# EAGLE design AtMEGA32u4-uSD-AddON-v03 (EAGLE 5.11)
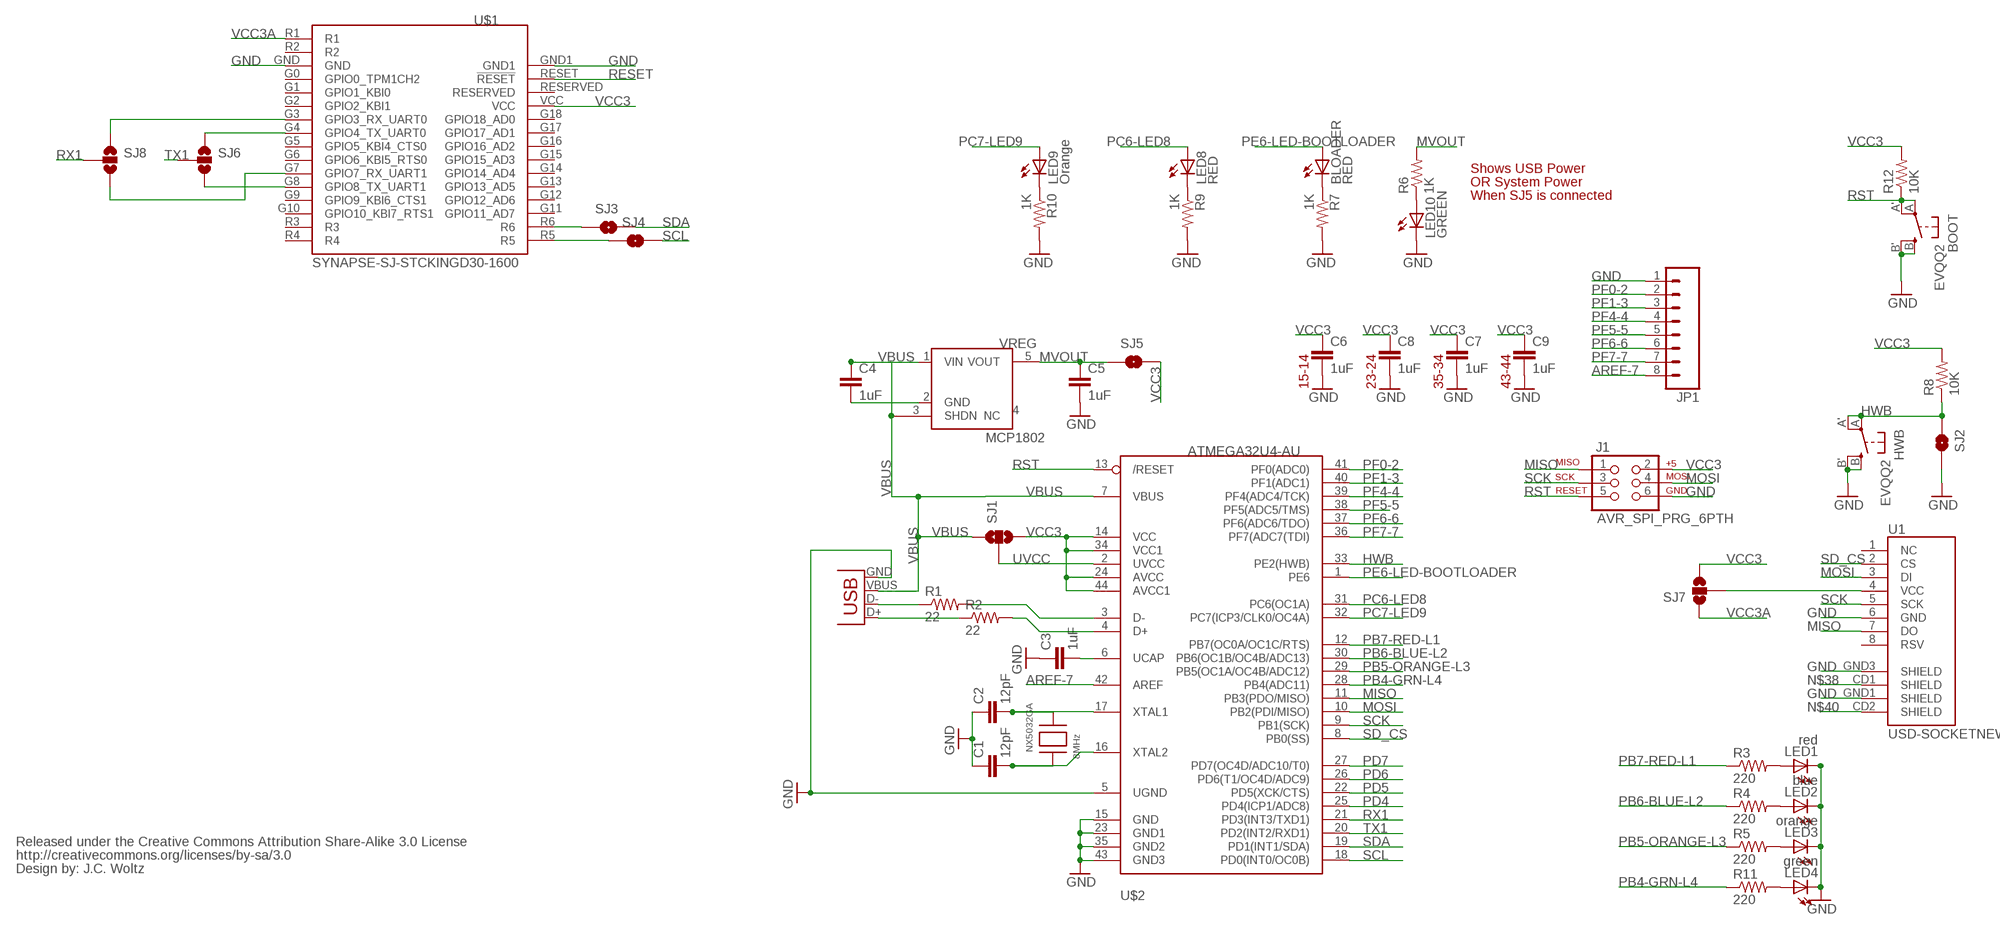
[diagram p0: schematic, sheet 1]

## Parts
BLOADER  RED  LED0603  [LED-0603]
BOOT  EVQQ2  [EVQ-Q2]
C1  12pF  CAP0603-CAP  [0603-CAP]
C2  12pF  CAP0603-CAP  [0603-CAP]
C3  1uF  CAP0603-CAP  [0603-CAP]
C4  1uF  CAP0603-CAP  [0603-CAP]
C5  1uF  CAP0603-CAP  [0603-CAP]
C6  1uF  CAP0603-CAP  [0603-CAP]
C7  1uF  CAP0603-CAP  [0603-CAP]
C8  1uF  CAP0603-CAP  [0603-CAP]
C9  1uF  CAP0603-CAP  [0603-CAP]
HWB  EVQQ2  [EVQ-Q2]
J1  AVR_SPI_PRG_6PTH  [2X3]
JP1  M08  [1X08]
LED1  red  LED0603  [LED-0603]
LED2  blue  LED0603  [LED-0603]
LED3  orange  LED0603  [LED-0603]
LED4  green  LED0603  [LED-0603]
LED8  RED  LED0603  [LED-0603]
LED9  Orange  LED0603  [LED-0603]
LED10  GREEN  LED0603  [LED-0603]
NX5032GA  8MHz  XTALNX5032  [NX5032]
R1  22  RESISTOR0603-RES  [0603-RES]
R2  22  RESISTOR0603-RES  [0603-RES]
R3  220  RESISTOR0603-RES  [0603-RES]
R4  220  RESISTOR0603-RES  [0603-RES]
R5  220  RESISTOR0603-RES  [0603-RES]
R6  1K  RESISTOR0603-RES  [0603-RES]
R7  1K  RESISTOR0603-RES  [0603-RES]
R8  10K  RESISTOR0603-RES  [0603-RES]
R9  1K  RESISTOR0603-RES  [0603-RES]
R10  1K  RESISTOR0603-RES  [0603-RES]
R11  220  RESISTOR0603-RES  [0603-RES]
R12  10K  RESISTOR0603-RES  [0603-RES]
SJ1  SOLDERJUMPER_2WAYPASTE2&3  [SJ_3_PASTE2&3]
SJ2  HWB  SOLDERJUMPERNO  [SJ_2S-NO]
SJ3  SOLDERJUMPERNO  [SJ_2S-NO]
SJ4  SOLDERJUMPERNO  [SJ_2S-NO]
SJ5  SOLDERJUMPERNO  [SJ_2S-NO]
SJ6  SOLDERJUMPER_2WAYPASTE1&2  [SJ_3_PASTE1&2]
SJ7  SOLDERJUMPER_2WAYPASTE1&2  [SJ_3_PASTE1&2]
SJ8  SOLDERJUMPER_2WAYPASTE1&2  [SJ_3_PASTE1&2]
U1  USD-SOCKETNEW  [MICRO-SD-SOCKET-PP]
U$1  SYNAPSE-SJ-STCKINGD30-1600  [SYNSJ-STACK]
U$2  ATMEGA32U4-AU  [TQFP44]
U$5  CREATIVE_COMMONS  [CREATIVE_COMMONS]
VREG  MCP1802  [SOT23-5]
X1  USBSMD  USBH2959CT-ND  [USB-MINIB]

## Nets
AREF-7: JP1.8 U$2.42(AREF)
GND: BOOT.B'(S1) BOOT.B(S) C1.1 C2.1 C3.1 C4.2 C5.2 C6.2 C7.2 C8.2 C9.2 HWB.B'(S1) HWB.B(S) J1.6 JP1.1 LED1.C LED2.C LED3.C LED4.C LED10.C R7.2 R9.2 R10.2 SJ2.2 U1.6(GND) U1.GND1(SHIELD) U1.GND3(SHIELD) U$1.GND U$1.GND1 U$2.5(UGND) U$2.15(GND) U$2.23(GND1) U$2.35(GND2) U$2.43(GND3) VREG.2(GND) X1.GND
HWB [smallsignal]: HWB.A'(P1) HWB.A(P) R8.1 SJ2.1 U$2.33(PE2(HWB))
MISO: J1.1 U1.7(DO) U$2.11(PB3(PDO/MISO))
MOSI: J1.4 U1.3(DI) U$2.10(PB2(PDI/MISO))
MVOUT: C5.1 R6.2 SJ5.1 VREG.5(VOUT)
N$1: LED9.C R10.1
N$2: LED1.A R3.2
N$3: SJ7.2 U1.4(VCC)
N$4: C3.2 U$2.6(UCAP)
N$5: LED4.A R11.2
N$7: LED2.A R4.2
N$8: LED10.A R6.1
N$9: LED8.C R9.1
N$10: BLOADER.C R7.1
N$11: SJ3.1 U$1.R6
N$12: LED3.A R5.2
N$13: SJ4.1 U$1.R5
N$14: SJ8.1 U$1.G3(GPIO3_RX_UART0)
N$15: SJ6.1 U$1.G4(GPIO4_TX_UART0)
N$16: SJ8.3 U$1.G7(GPIO7_RX_UART1)
N$17: SJ6.3 U$1.G8(GPIO8_TX_UART1)
N$38: U1.CD1(SHIELD)
N$40: U1.CD2(SHIELD)
PB4-GRN-L4: R11.1 U$2.28(PB4(ADC11))
PB5-ORANGE-L3: R5.1 U$2.29(PB5(OC1A/OC4B/ADC12))
PB6-BLUE-L2: R4.1 U$2.30(PB6(OC1B/OC4B/ADC13))
PB7-RED-L1: R3.1 U$2.12(PB7(OC0A/OC1C/RTS))
PC6-LED8: LED8.A U$2.31(PC6(OC1A))
PC7-LED9: LED9.A U$2.32(PC7(ICP3/CLK0/OC4A))
PD4: U$2.25(PD4(ICP1/ADC8))
PD5: U$2.22(PD5(XCK/CTS))
PD6: U$2.26(PD6(T1/OC4D/ADC9))
PD7: U$2.27(PD7(OC4D/ADC10/T0))
PE6-LED-BOOTLOADER: BLOADER.A U$2.1(PE6)
PF0-2: JP1.2 U$2.41(PF0(ADC0))
PF1-3: JP1.3 U$2.40(PF1(ADC1))
PF4-4: JP1.4 U$2.39(PF4(ADC4/TCK))
PF5-5: JP1.5 U$2.38(PF5(ADC5/TMS))
PF6-6: JP1.6 U$2.37(PF6(ADC6/TDO))
PF7-7: JP1.7 U$2.36(PF7(ADC7(TDI))
RESET: U$1.RESET(!RESET)
RST [smallsignal]: BOOT.A'(P1) BOOT.A(P) J1.5 R12.1 U$2.13(/RESET)
RX1: SJ8.2 U$2.21(PD3(INT3/TXD1))
SCK: J1.3 U1.5(SCK) U$2.9(PB1(SCK))
SCL: SJ4.2 U$2.18(PD0(INT0/OC0B))
SD_CS: U1.2(CS) U$2.8(PB0(SS))
SDA: SJ3.2 U$2.19(PD1(INT1/SDA))
TX1: SJ6.2 U$2.20(PD2(INT2/RXD1))
UD+: R2.2 U$2.4(D+)
UD-: R1.2 U$2.3(D-)
UDM: R1.1 X1.D-
UDP: R2.1 X1.D+
UVCC: SJ1.2 U$2.2(UVCC)
VBUS: C4.1 SJ1.1 U$2.7(VBUS) VREG.1(VIN) VREG.3(SHDN) X1.VBUS
VCC3: C6.1 C7.1 C8.1 C9.1 J1.2 R8.2 R12.2 SJ1.3 SJ5.2 SJ7.3 U$1.VCC U$2.14(VCC) U$2.24(AVCC) U$2.34(VCC1) U$2.44(AVCC1)
VCC3A: SJ7.1 U$1.R1
XTAL1: C2.2 NX5032GA.P$2 U$2.17(XTAL1)
XTAL2: C1.2 NX5032GA.P$1 U$2.16(XTAL2)
Unconnected: U1.1(NC) U1.8(RSV) U$1.G0(GPIO0_TPM1CH2) U$1.G1(GPIO1_KBI0) U$1.G2(GPIO2_KBI1) U$1.G5(GPIO5_KBI4_CTS0) U$1.G6(GPIO6_KBI5_RTS0) U$1.G9(GPIO9_KBI6_CTS1) U$1.G10(GPIO10_KBI7_RTS1) U$1.G11(GPIO11_AD7) U$1.G12(GPIO12_AD6) U$1.G13(GPIO13_AD5) U$1.G14(GPIO14_AD4) U$1.G15(GPIO15_AD3) U$1.G16(GPIO16_AD2) U$1.G17(GPIO17_AD1) U$1.G18(GPIO18_AD0) U$1.R2 U$1.R3 U$1.R4 U$1.RESERVED VREG.4(NC)

## Notes on the sheet
- Shows USB Power
- OR System Power
- When SJ5 is connected
- 15-14 | 23-24 | 35-34 | 43-44

## Library data of the parts
BLOADER LED1-LED4 LED8-LED10 = 0_jc-custom:LED: LEDs Standard schematic elements and footprints for 5mm, 3mm, 1206, and 0603 sized LEDs. 5mm - Spark Fun Electronics SKU : COM-00529 (and others)
BOOT HWB = adaprog:EVQQ2
C1 C2 = SparkFun:CAP: Capacitor Standard 0603 ceramic capacitor, and 0.1" leaded capacitor.
C3-C9 = 0_jc-custom:CAP: Capacitor Standard 0603 ceramic capacitor, and 0.1" leaded capacitor.
J1 = SparkFun:AVR_SPI_PRG_6: AVR ISP 6 Pin This is the reduced ISP connector for AVR programming. Common on Arduino. This footprint will take up less PCB space and can be used with a 10-pin to 6-pin adapter such as SKU: BOB-08508
JP1 = SparkFun:M08: Header 8 Standard 8-pin 0.1" header. Use with straight break away headers (SKU : PRT-00116), right angle break away headers (PRT-00553), swiss pins (PRT-00743), machine pins (PRT-00117), and female headers (PRT-00115).
NX5032GA = adafruit:XTAL: Low cost SMT crystals, no capacitors included http://www.ladyada.net/library/eagle
R1-R12 = 0_jc-custom:RESISTOR
SJ1 SJ6-SJ8 = SparkFun:SOLDERJUMPER_2WAY: Solder Jumper 2 way solder jumper
SJ2-SJ5 = SparkFun:SOLDERJUMPER: Solder Jumper Standard SMD solder jumper. Used to automate production. Two varients : Normally Open and Normally Closed are the same, but have different paste layers. NC will have a large amount of paste and should jumper during reflow.
U1 = 0_jc-modified:USD-SOCKET: microSD Socket Push-push type uSD socket. Schematic element and footprint production proven. Spark Fun Electronics SKU : PRT-00127. tDoc lines correctly indicate media card edge positions when inserting (unlocked, locked, depressed).
U$1 = 0_jc-custom:SYNAPSE-SJ-STCKING: Standard layout for expansion modules using Synapse Wireless boards
U$2 = adafruit:ATMEGA32U4: http://www.ladyada.net/library/eagle
U$5 = 0_jc-custom:CREATIVE_COMMONS
VREG = 0_jc-custom:MCP1802
X1 = 0_jc-custom:USB: USB Connectors Fully proven 670-1190-1-ND http://search.digikey.com/scripts/DkSearch/dksus.dll?Detail&name=670-1190-1-ND

## Net classes
0 default: width 0.203 mm
1 smallsignal: width 0.152 mm
2 bigsignal: width 0.356 mm

## Board
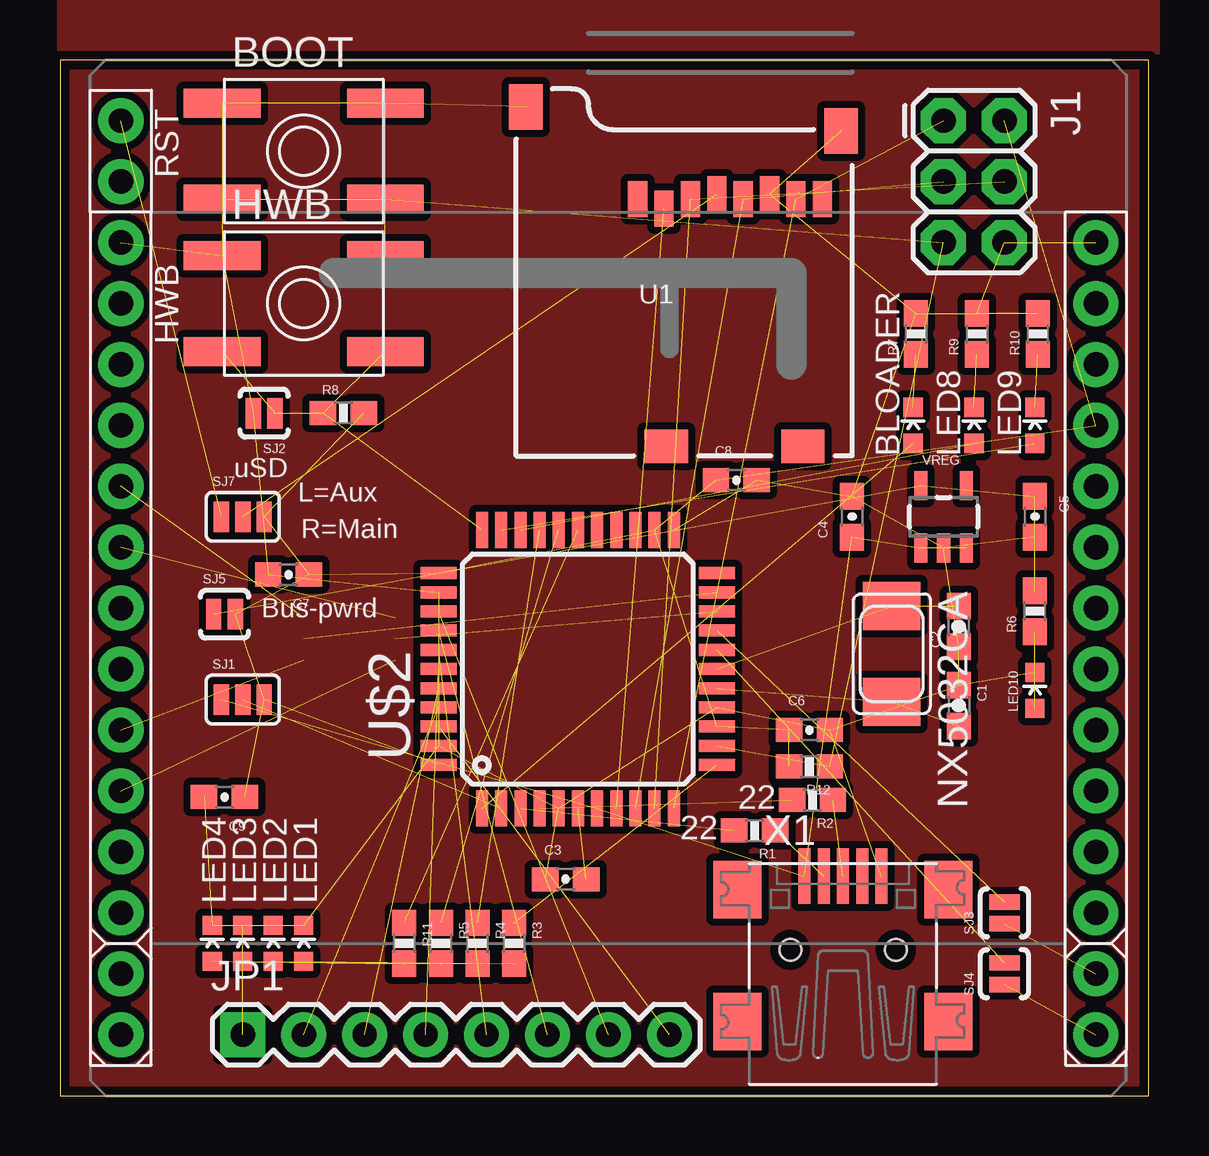
[diagram p1: board, top side]
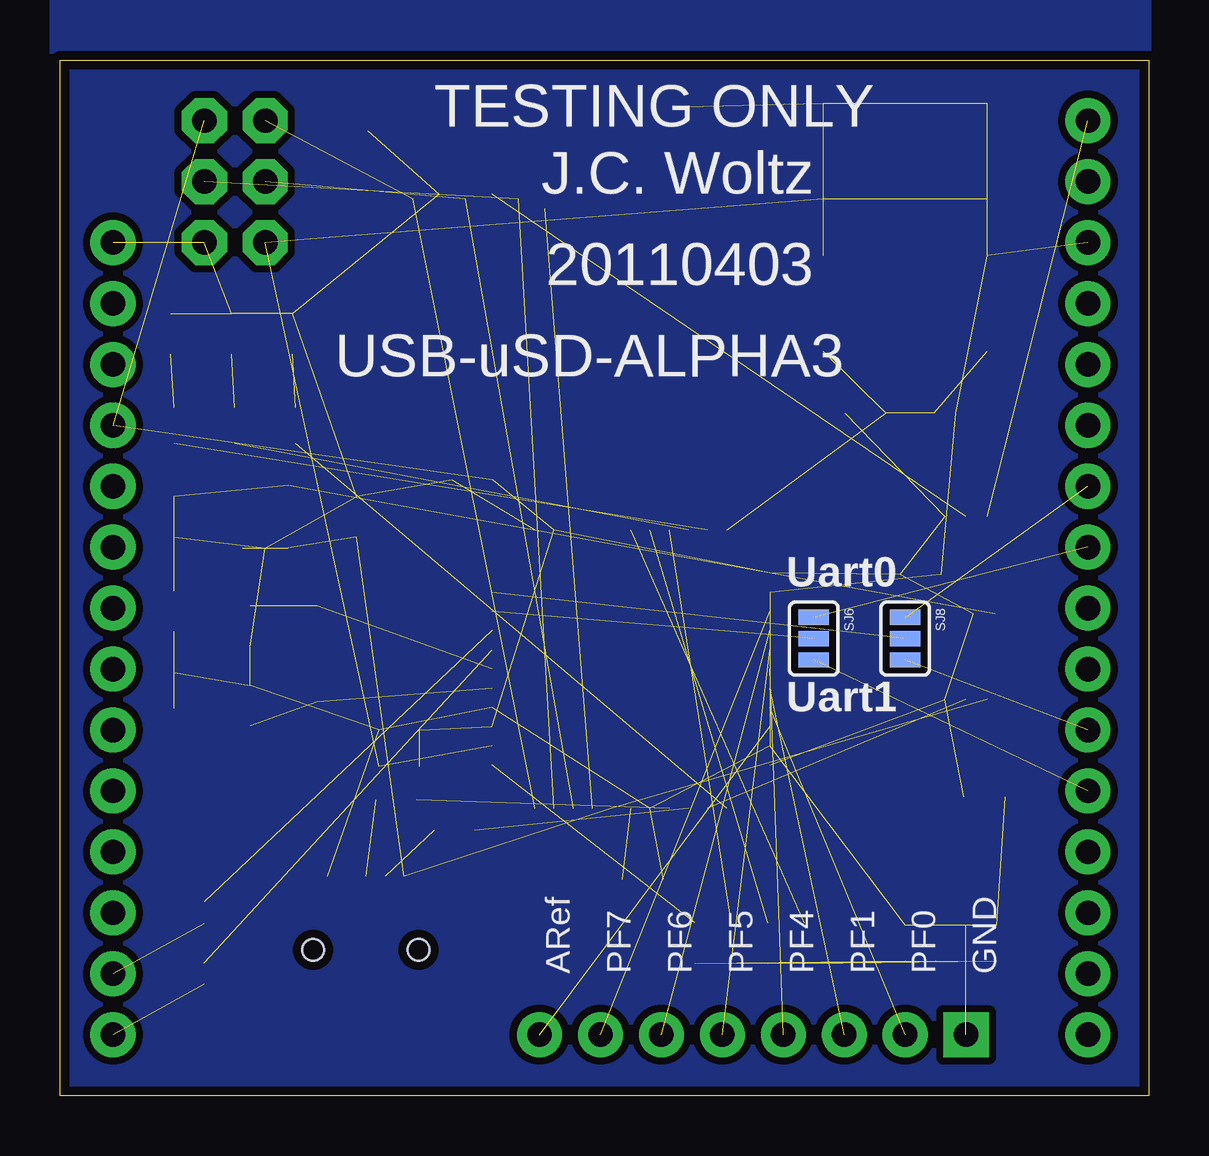
[diagram p2: board, bottom side, seen from below]

Size 45.39 x 43.17 mm. Coordinates in mm from the lower left corner, seen from the top.
Outline: 0,0 45.39,0 45.39,43.17 0,43.17 0,0
Copper layers (1*16): Top 0.0356mm / dielectric 1.5011mm / Bottom 0.0356mm
Design rules "LaenPCBOrder-JCModified": minimum track width 6mil, minimum drill 13mil, track to track 6mil, track to pad 6mil, pad to pad 6mil, via to via 6mil, smd to smd 6mil, copper to edge 15mil, drill to drill 6mil, minimum pad ring 12mil, minimum via ring 7mil, stop-mask expansion 4mil, vias tented up to drill 25mil, thermal gap 10mil

### Footprints (pad centres in the part's own frame; a part is rotated, then mirrored left to right if it is on the bottom)
LED-0603 = smd 0.8 x 0.8: A 0,-0.75; C 0,0.75
EVQ-Q2 = smd 3.2 x 1.2: A -3.4,-2; A' 3.4,-2; B -3.4,2; B' 3.4,2
0603-CAP = smd 1.1 x 1: 1 -0.85,0; 2 0.85,0
2X3 = drill 1.016 pad 1.88 octagon: 1 0,0; 2 0,2.54; 3 2.54,0; 4 2.54,2.54; 5 5.08,0; 6 5.08,2.54
1X08 = drill 1.016 pad 1.88 square: 1 0,0 | drill 1.016 pad 1.88 round: 2 2.54,0; 3 5.08,0; 4 7.62,0; 5 10.16,0; 6 12.7,0; 7 15.24,0; 8 17.78,0
NX5032 = smd 2 x 2.4: P$1 2,0; P$2 -2,0
0603-RES = smd 1.1 x 1: 1 -0.85,0; 2 0.85,0
SJ_3_PASTE2&3 = smd 0.635 x 1.27: 1 -0.889,0; 2 0,0; 3 0.889,0
SJ_2S-NO = smd 0.635 x 1.27: 1 -0.45,0; 2 0.45,0
SJ_3_PASTE1&2 = smd 0.635 x 1.27: 1 -0.889,0; 2 0,0; 3 0.889,0
MICRO-SD-SOCKET-PP = smd 0.8 x 1.5: 1 -8.94,10.7; 2 -7.84,10.3; 3 -6.74,10.7; 4 -5.64,10.9; 5 -4.54,10.7; 6 -3.44,10.9; 7 -2.34,10.7; 8 -1.24,10.7 | smd 1.8 x 1.4: CD1 -2.05,0.4; CD2 -7.75,0.4 | smd 1.4 x 1.9: GND1 -13.6,14.55; GND3 -0.45,13.55
SYNSJ-STACK = drill 1.016 pad 1.88 round: G0 0,-7.62; G1 0,-10.16; G2 0,-12.7; G3 0,-15.24; G4 0,-17.78; G5 0,-20.32; G6 0,-22.86; G7 0,-25.4; G8 0,-27.94; G9 0,-30.48; G10 0,-33.02; G11 40.64,-33.02; G12 40.64,-30.48; G13 40.64,-27.94; G14 40.64,-25.4; G15 40.64,-22.86; G16 40.64,-20.32; G17 40.64,-17.78; G18 40.64,-15.24; GND 0,-5.08; GND1 40.64,-5.08; R1 0,0; R2 0,-2.54; R3 0,-35.56; R4 0,-38.1; R5 40.64,-38.1; R6 40.64,-35.56; RESERVED 40.64,-10.16; RESET 40.64,-7.62; VCC 40.64,-12.7
TQFP44 = smd 1.5 x 0.5: 1 -5.8,4; 2 -5.8,3.2; 3 -5.8,2.4; 4 -5.8,1.6; 5 -5.8,0.8; 6 -5.8,0; 7 -5.8,-0.8; 8 -5.8,-1.6; 9 -5.8,-2.4; 10 -5.8,-3.2; 11 -5.8,-4; 23 5.8,-4; 24 5.8,-3.2; 25 5.8,-2.4; 26 5.8,-1.6; 27 5.8,-0.8; 28 5.8,0; 29 5.8,0.8; 30 5.8,1.6; 31 5.8,2.4; 32 5.8,3.2; 33 5.8,4 | smd 0.5 x 1.5: 12 -4,-5.8; 13 -3.2,-5.8; 14 -2.4,-5.8; 15 -1.6,-5.8; 16 -0.8,-5.8; 17 0,-5.8; 18 0.8,-5.8; 19 1.6,-5.8; 20 2.4,-5.8; 21 3.2,-5.8; 22 4,-5.8; 34 4,5.8; 35 3.2,5.8; 36 2.4,5.8; 37 1.6,5.8; 38 0.8,5.8; 39 0,5.8; 40 -0.8,5.8; 41 -1.6,5.8; 42 -2.4,5.8; 43 -3.2,5.8; 44 -4,5.8
SOT23-5 = smd 0.55 x 1.2: 1 -0.95,-1.3; 2 0,-1.3; 3 0.95,-1.3; 4 0.95,1.3; 5 -0.95,1.3
USB-MINIB = smd 0.5 x 2.308: D+ 0,4.064; D- -0.8,4.064; GND 1.6,4.064; ID 0.8,4.064; VBUS -1.6,4.064 | smd 2 x 2.4: GND1 -4.4,-2; GND2 -4.4,3.5; GND3 4.4,3.5; GND4 4.4,-2 | hole 0.9: -2.2,1; 2.2,1

### Placement (x,y rotation side)
BLOADER  35.56,27.94 0 top
BOOT  10.16,39.37 0 top
C1  37.47,16.26 270 top
C2  37.47,19.56 90 top
C3  21.08,9.02 0 top
C4  33.02,24.13 90 top
C5  40.64,24.13 270 top
C6  31.24,15.24 0 top
C7  9.52,21.72 180 top
C8  28.19,25.65 0 top
C9  6.86,12.45 180 top
HWB  10.16,33.02 0 top
J1  36.83,40.64 270 top
JP1  7.62,2.54 0 top
LED1  10.16,6.35 0 top
LED2  8.89,6.35 0 top
LED3  7.62,6.35 0 top
LED4  6.35,6.35 0 top
LED8  38.1,27.94 0 top
LED9  40.64,27.94 0 top
LED10  40.64,16.89 0 top
NX5032GA  34.67,18.41 270 top
R1  28.96,11.05 180 top
R2  31.37,12.32 180 top
R3  18.92,6.35 270 top
R4  17.4,6.35 270 top
R5  15.88,6.35 270 top
R6  40.64,20.19 90 top
R7  35.69,31.75 90 top
R8  11.81,28.45 0 top
R9  38.23,31.75 90 top
R10  40.77,31.75 90 top
R11  14.35,6.35 270 top
R12  31.24,13.72 180 top
SJ1  7.62,16.51 0 top
SJ2  8.51,28.45 180 top
SJ3  39.37,7.62 90 top
SJ4  39.37,5.08 90 top
SJ5  6.86,20.07 0 top
SJ6  13.97,19.05 270 bottom
SJ7  7.62,24.13 0 top
SJ8  10.16,19.05 270 bottom
U1  33.02,26.67 0 top
U$1  2.54,40.64 0 top
U$2  21.59,17.78 90 top
U$5  3.81,-8.89 0 top  (outside the outline)
VREG  36.83,24.13 0 top
X1  32.64,5.08 0 top

### Tracks (layer width: path | path; a pad name or v marks a point on that pad's centre or on a via)
AREF-7  (1 unrouted)
BOB
  pour Top (isolate 0.305): 0,45.72 45.72,45.72 45.72,0 0,0
  pour Bottom (isolate 0.305): 0,45.72 45.72,45.72 45.72,0 0,0
GND  (35 unrouted)
HWB  (4 unrouted)
MISO  (2 unrouted)
MOSI  (2 unrouted)
MVOUT  (3 unrouted)
N$1  (1 unrouted)
N$2  (1 unrouted)
N$3  (1 unrouted)
N$4  (1 unrouted)
N$5  (1 unrouted)
N$7  (1 unrouted)
N$8  (1 unrouted)
N$9  (1 unrouted)
N$10  (1 unrouted)
N$11  (1 unrouted)
N$12  (1 unrouted)
N$13  (1 unrouted)
N$14  (1 unrouted)
N$15  (1 unrouted)
N$16  (1 unrouted)
N$17  (1 unrouted)
PB4-GRN-L4  (1 unrouted)
PB5-ORANGE-L3  (1 unrouted)
PB6-BLUE-L2  (1 unrouted)
PB7-RED-L1  (1 unrouted)
PC6-LED8  (1 unrouted)
PC7-LED9  (1 unrouted)
PE6-LED-BOOTLOADER  (1 unrouted)
PF0-2  (1 unrouted)
PF1-3  (1 unrouted)
PF4-4  (1 unrouted)
PF5-5  (1 unrouted)
PF6-6  (1 unrouted)
PF7-7  (1 unrouted)
RST  (4 unrouted)
RX1  (1 unrouted)
SCK  (2 unrouted)
SCL  (1 unrouted)
SD_CS  (1 unrouted)
SDA  (1 unrouted)
TX1  (1 unrouted)
UD+  (1 unrouted)
UD-  (1 unrouted)
UDM  (1 unrouted)
UDP  (1 unrouted)
UVCC  (1 unrouted)
VBUS  (5 unrouted)
VCC3  (14 unrouted)
VCC3A  (1 unrouted)
XTAL1  (2 unrouted)
XTAL2  (2 unrouted)

### Text on the board
tPlace: RST | HWB | uSD | L=Aux | R=Main | Bus-pwrd
bPlace: TESTING ONLY | J.C. Woltz | 20110403 | USB-uSD-ALPHA3 | Uart0 | Uart1 | GND | PF0 | PF1 | PF4 | PF5 | PF6 | PF7 | ARef